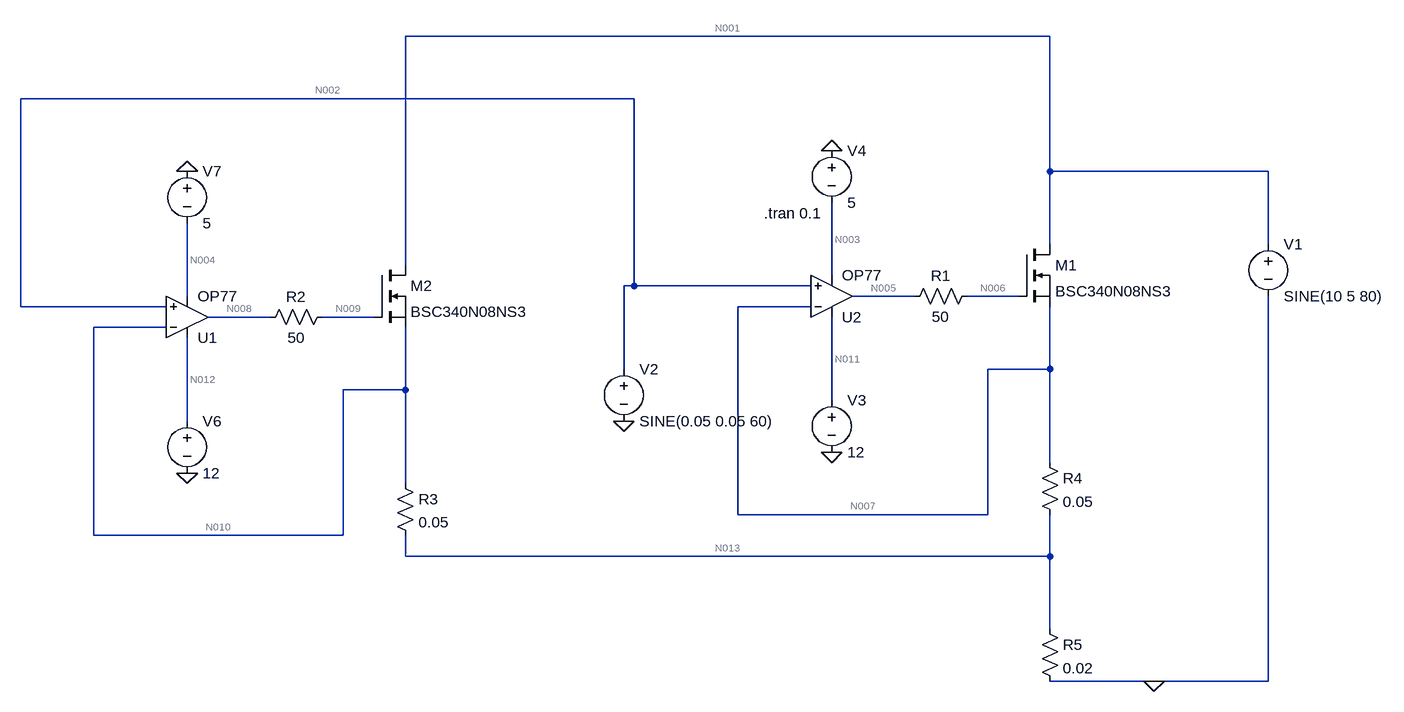
[diagram p0: schematic ELOAD LOOP 2.asc]
ELOAD LOOP 2.asc, the LTspice schematic file:
Version 4
SHEET 1 1056 804
WIRE 528 -208 -464 -208
WIRE -112 -112 -1056 -112
WIRE 528 0 528 -208
WIRE 864 0 528 0
WIRE 528 112 528 0
WIRE 864 112 864 0
WIRE -464 144 -464 -208
WIRE 192 160 192 48
WIRE -112 176 -112 -112
WIRE -112 176 -128 176
WIRE 160 176 -112 176
WIRE -800 192 -800 80
WIRE 320 192 224 192
WIRE 480 192 400 192
WIRE -1056 208 -1056 -112
WIRE -832 208 -1056 208
WIRE 160 208 48 208
WIRE -672 224 -768 224
WIRE -512 224 -592 224
WIRE -832 240 -944 240
WIRE -128 304 -128 176
WIRE 528 304 528 208
WIRE 528 304 432 304
WIRE -464 336 -464 240
WIRE -464 336 -560 336
WIRE 192 352 192 224
WIRE -800 384 -800 256
WIRE 528 448 528 304
WIRE -464 480 -464 336
WIRE 48 528 48 208
WIRE 432 528 432 304
WIRE 432 528 48 528
WIRE -944 560 -944 240
WIRE -560 560 -560 336
WIRE -560 560 -944 560
WIRE -464 592 -464 560
WIRE 528 592 528 528
WIRE 528 592 -464 592
WIRE 528 704 528 592
WIRE 688 784 528 784
WIRE 864 784 864 192
WIRE 864 784 688 784
FLAG -128 384 0
FLAG 192 432 0
FLAG 192 -32 0
FLAG -800 464 0
FLAG -800 0 0
FLAG 688 784 0
SYMBOL nmos 480 112 R0
SYMATTR InstName M1
SYMATTR Value BSC340N08NS3
SYMBOL res 416 176 R90
WINDOW 0 0 56 VBottom 2
WINDOW 3 32 56 VTop 2
SYMATTR InstName R1
SYMATTR Value 50
SYMBOL voltage 864 96 R0
WINDOW 123 0 0 Left 0
WINDOW 39 0 0 Left 0
SYMATTR InstName V1
SYMATTR Value SINE(10 5 80)
SYMBOL res 512 432 R0
SYMATTR InstName R4
SYMATTR Value 0.05
SYMBOL voltage -128 288 R0
WINDOW 123 0 0 Left 0
WINDOW 39 0 0 Left 0
SYMATTR InstName V2
SYMATTR Value SINE(0.05 0.05 60)
SYMBOL OpAmps\\OP77 192 256 M180
SYMATTR InstName U2
SYMBOL voltage 192 336 R0
WINDOW 123 0 0 Left 0
WINDOW 39 0 0 Left 0
SYMATTR InstName V3
SYMATTR Value 12
SYMBOL voltage 192 -48 R0
WINDOW 123 0 0 Left 0
WINDOW 39 0 0 Left 0
SYMATTR InstName V4
SYMATTR Value 5
SYMBOL nmos -512 144 R0
SYMATTR InstName M2
SYMATTR Value BSC340N08NS3
SYMBOL res -576 208 R90
WINDOW 0 0 56 VBottom 2
WINDOW 3 32 56 VTop 2
SYMATTR InstName R2
SYMATTR Value 50
SYMBOL res -480 464 R0
SYMATTR InstName R3
SYMATTR Value 0.05
SYMBOL OpAmps\\OP77 -800 288 M180
SYMATTR InstName U1
SYMBOL voltage -800 368 R0
WINDOW 123 0 0 Left 0
WINDOW 39 0 0 Left 0
SYMATTR InstName V6
SYMATTR Value 12
SYMBOL voltage -800 -16 R0
WINDOW 123 0 0 Left 0
WINDOW 39 0 0 Left 0
SYMATTR InstName V7
SYMATTR Value 5
SYMBOL res 512 688 R0
SYMATTR InstName R5
SYMATTR Value 0.02
TEXT 88 64 Left 2 !.tran 0.1

The netlist it stands for:
* ELOAD LOOP 2.asc
M1 N001 N006 N007 N007 BSC340N08NS3
R1 N006 N005 50
V1 N001 0 SINE(10 5 80)
R4 N007 N013 0.05
V2 N002 0 SINE(0.05 0.05 60)
XU2 N002 N007 N011 N003 N005 OP77  ; pins In+ In- V+ V- OUT
V3 N011 0 12
V4 0 N003 5
M2 N001 N009 N010 N010 BSC340N08NS3
R2 N009 N008 50
R3 N010 N013 0.05
XU1 N002 N010 N012 N004 N008 OP77  ; pins In+ In- V+ V- OUT
V6 N012 0 12
V7 0 N004 5
R5 N013 0 0.02
.model NMOS NMOS
.model PMOS PMOS
.lib standard.mos
.tran 0.1
.lib ADI.lib
.backanno
.end

* Results of the author's LTspice run, read from the files saved beside the schematic
* Operating Point, zero values left out:
*   V(n001) = 10 V
*   V(n006) = 4.138 V
*   V(n007) = 50.01 mV
*   V(n005) = 4.138 V
*   V(n013) = 22.23 mV
*   V(n002) = 50 mV
*   V(n011) = 12 V
*   V(n003) = -5 V
*   V(n009) = 4.138 V
*   V(n010) = 50.01 mV
*   V(n008) = 4.138 V
*   V(n012) = 12 V
*   V(n004) = -5 V
*   Id(M1) = 555.7 mA
*   Is(M1) = -555.7 mA
*   Id(M2) = 555.7 mA
*   Is(M2) = -555.7 mA
*   I(R4) = 555.7 mA
*   I(R3) = 555.7 mA
*   I(R5) = 1.111 A
*   I(V1) = -1.111 A
*   I(V2) = -2.676 nA
*   I(V3) = -1.048 mA
*   I(V4) = -1.048 mA
*   I(V6) = -1.048 mA
*   I(V7) = -1.048 mA
*   Ix(u2:1) = 1.338 nA
*   Ix(u2:2) = 1.038 nA
*   Ix(u2:99) = 1.048 mA
*   Ix(u2:50) = -1.048 mA
*   Ix(u1:1) = 1.338 nA
*   Ix(u1:2) = 1.038 nA
*   Ix(u1:99) = 1.048 mA
*   Ix(u1:50) = -1.048 mA
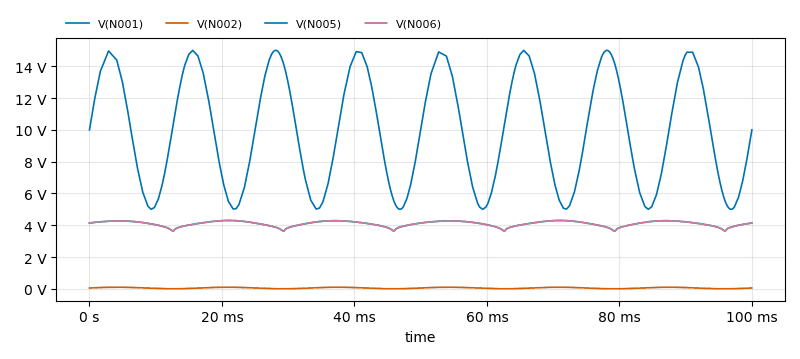
[diagram p1: Transient Analysis of ELOAD LOOP 2.asc, plotted from the saved traces]
* Transient Analysis, 1 run:
*   V(N001): min 5 V, max 15 V, average 9.992 V, rms 10.6 V, last 10 V
*   V(N002): min 65.74 nV, max 99.99 mV, average 49.9 mV, rms 61.19 mV, last 50 mV
*   V(N005): min 3.627 V, max 4.298 V, average 4.095 V, rms 4.099 V, last 4.138 V
*   V(N006): min 3.627 V, max 4.298 V, average 4.095 V, rms 4.099 V, last 4.138 V